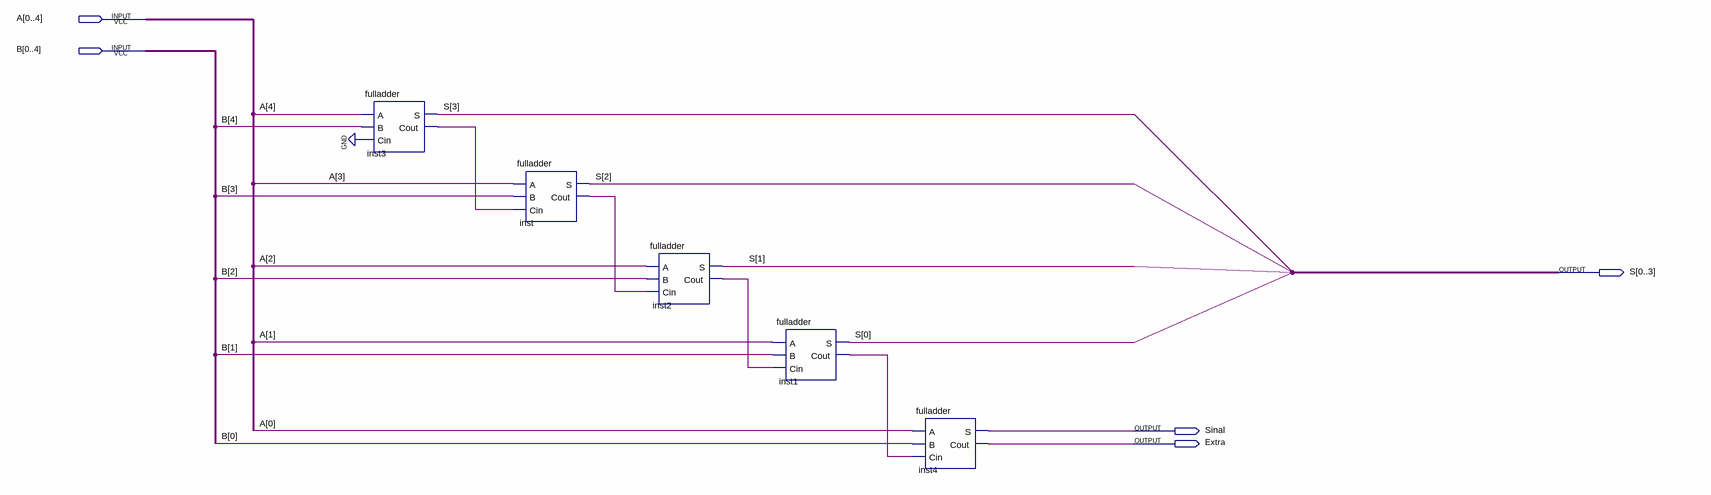
[diagram p0: schematic sheet]
// Quartus schematic adder5bits.bdf as structural Verilog: 5 symbols, 5 pins
module adder5bits (
  input  [0:4] A,
  input  [0:4] B,
  output [0:3] S,
  output Sinal,
  output Extra
);

  wire inst1_cout, inst2_cout, inst3_cout, inst_cout;

  fulladder inst3 (.A(A[4]), .B(B[4]), .Cin(1'b0), .S(S[3]), .Cout(inst3_cout));
  fulladder inst (.A(A[3]), .B(B[3]), .Cin(inst3_cout), .S(S[2]), .Cout(inst_cout));
  fulladder inst2 (.A(A[2]), .B(B[2]), .Cin(inst_cout), .S(S[1]), .Cout(inst2_cout));
  fulladder inst1 (.A(A[1]), .B(B[1]), .Cin(inst2_cout), .S(S[0]), .Cout(inst1_cout));
  fulladder inst4 (.A(A[0]), .B(B[0]), .Cin(inst1_cout), .S(Sinal), .Cout(Extra));
endmodule
